# Altium schematic sheet RadioPod.SchDoc
size A3; PageSetup: Record=PageOptions|CenterHorizontal=True|CenterVertical=True|PrintScale=1.00|XCorrection=1.00|YCorrection=1.00|PrintKind=1|BorderSize=5000000|LeftOffset=0|BottomOffset=0|Orientation=2|PaperLength=1000|PaperWidth=1000|Scale=100|PaperSource=7|PrintQuality=-3|MediaType=1|DitherType=10|PrintScaleMode=1|PaperKind=A4|PaperIndex=9
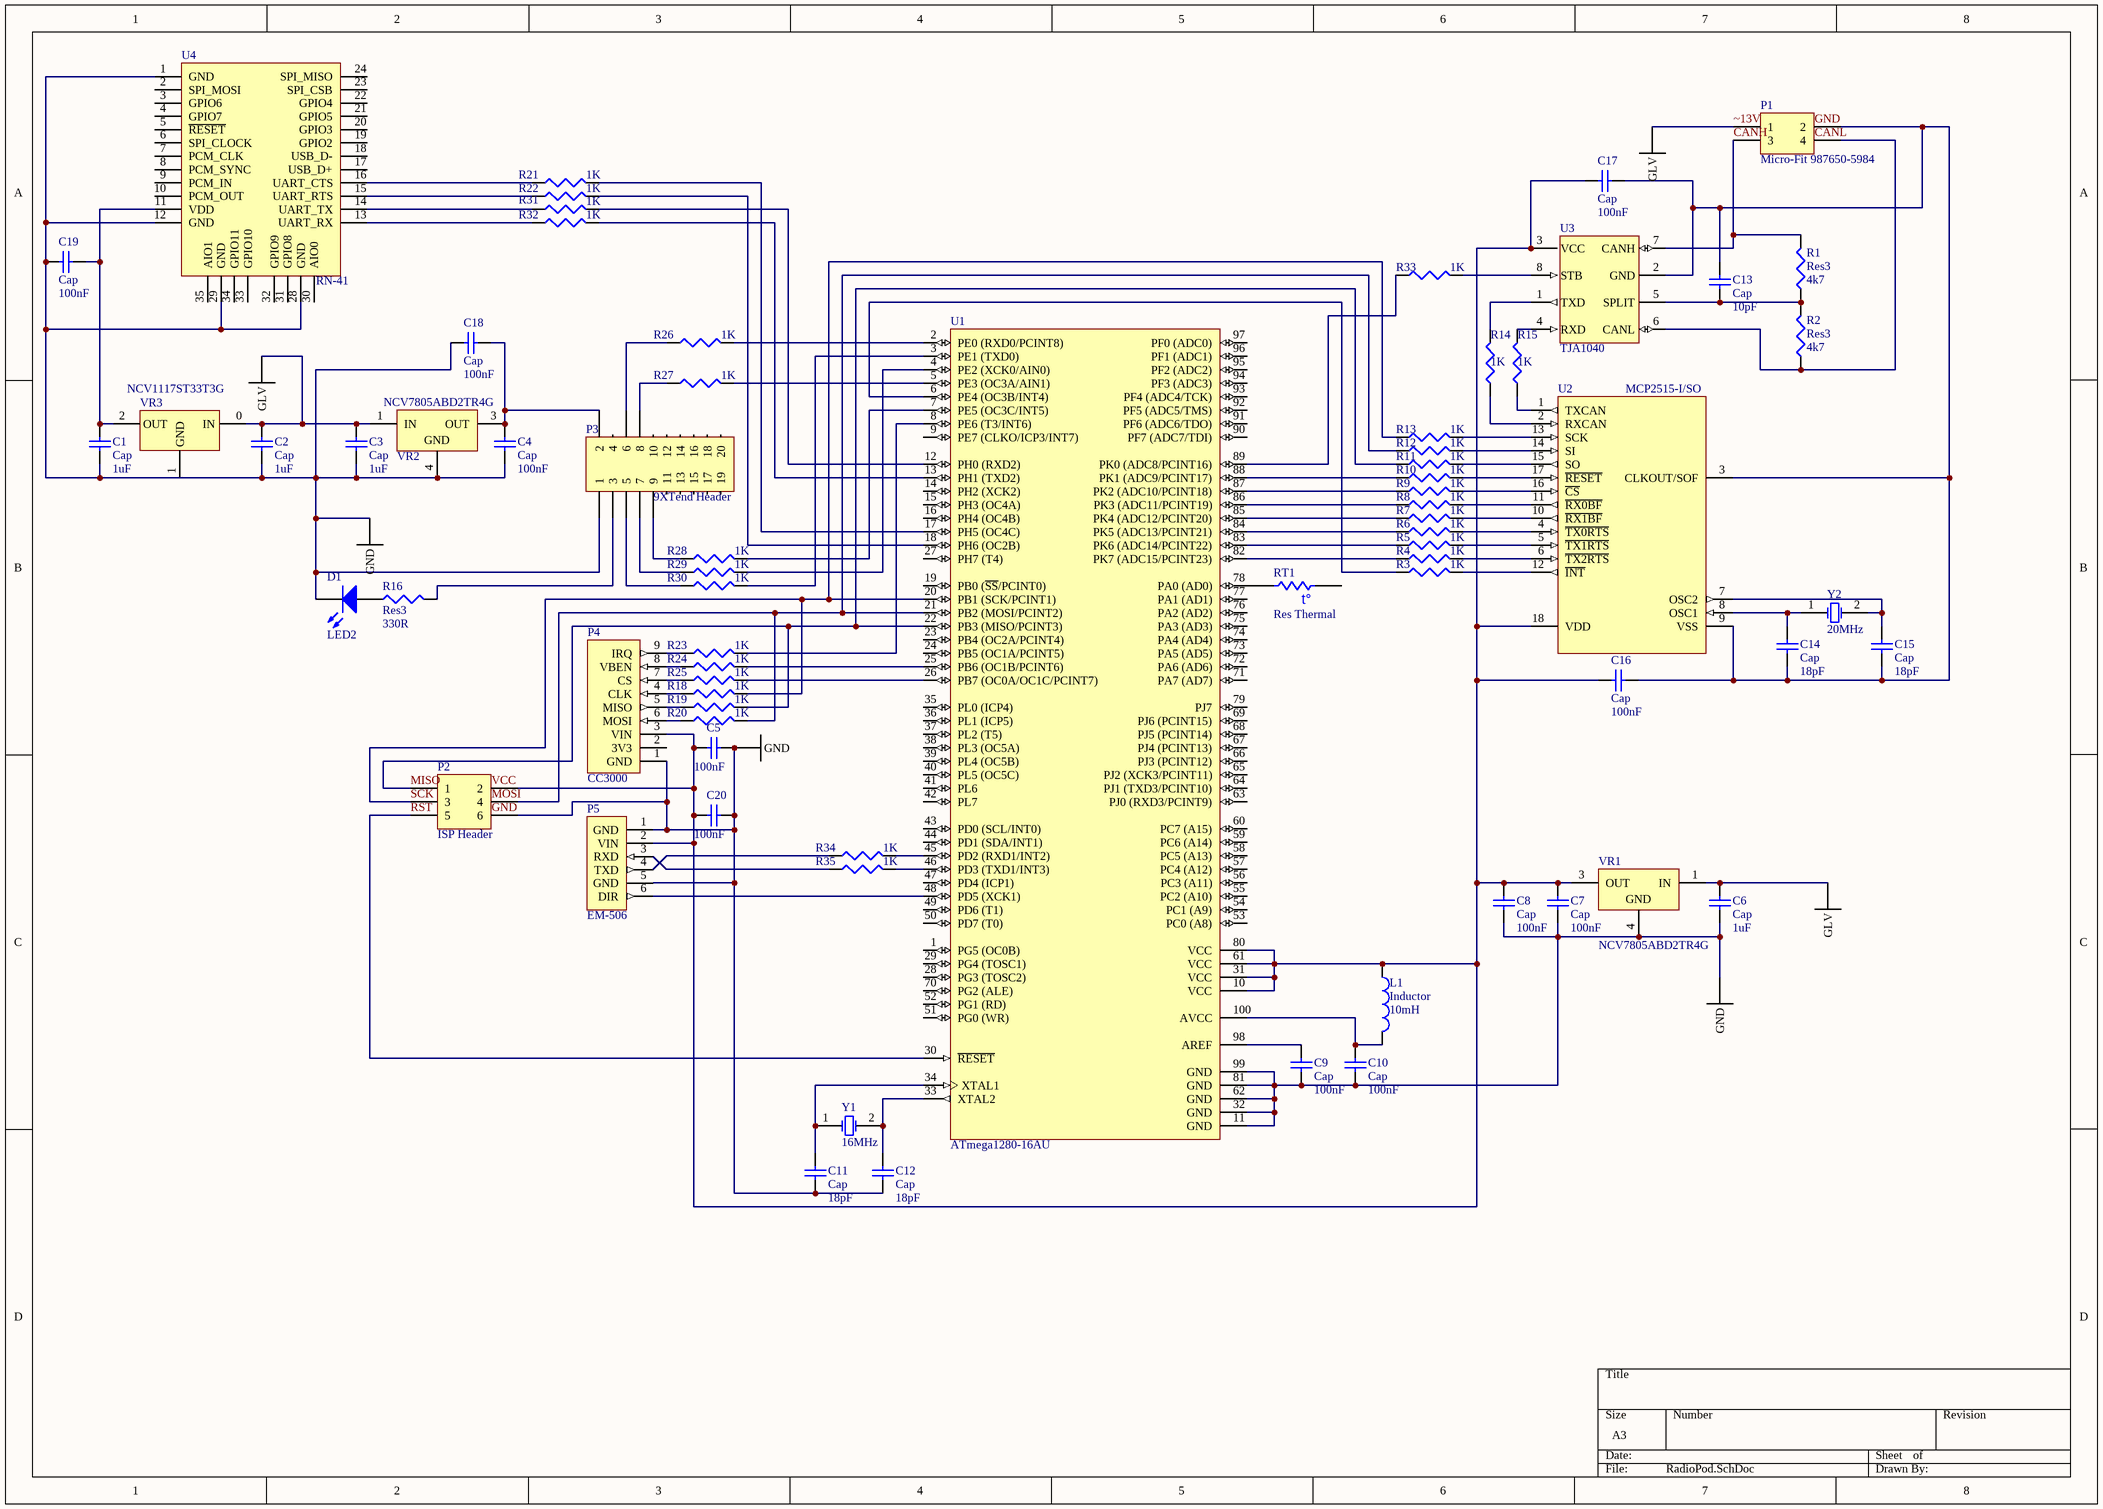
[diagram p0: RadioPod.SchDoc]

## Parts
C1  Cap  value 1uF  [RAD-0.3]
C2  Cap  value 1uF  [RAD-0.3]
C3  Cap  value 1uF  [RAD-0.3]
C4  Cap  value 100nF  [RAD-0.3]
C5  value 100nF  [RAD-0.3]  (hidden comment: Cap)
C6  Cap  value 1uF  [RAD-0.3]
C7  Cap  value 100nF  [RAD-0.3]
C8  Cap  value 100nF  [RAD-0.3]
C9  Cap  value 100nF  [RAD-0.3]
C10  Cap  value 100nF  [RAD-0.3]
C11  Cap  value 18pF  [RAD-0.3]
C12  Cap  value 18pF  [RAD-0.3]
C13  Cap  value 10pF  [RAD-0.3]
C14  Cap  value 18pF  [RAD-0.3]
C15  Cap  value 18pF  [RAD-0.3]
C16  Cap  value 100nF  [RAD-0.3]
C17  Cap  value 100nF  [RAD-0.3]
C18  Cap  value 100nF  [RAD-0.3]
C19  Cap  value 100nF  [RAD-0.3]
C20  value 100nF  [RAD-0.3]  (hidden comment: Cap)
D1  LED2  [3.2X1.6X1.1]
L1  Inductor  value 10mH  [0402-A]
P1  Micro-Fit 987650-5984  [HDR2X2]
P2  ISP Header  [HDR2X3]
P3  9XTend Header  [HDR2X10]
P4  CC3000  [Header 9]
P5  EM-506  [EM_506]
R1  Res3  value 4k7  [J1-0603]
R2  Res3  value 4k7  [J1-0603]
R3  value 1K  [J1-0603]  (hidden comment: Res3)
R4  value 1K  [J1-0603]  (hidden comment: Res3)
R5  value 1K  [J1-0603]  (hidden comment: Res3)
R6  value 1K  [J1-0603]  (hidden comment: Res3)
R7  value 1K  [J1-0603]  (hidden comment: Res3)
R8  value 1K  [J1-0603]  (hidden comment: Res3)
R9  value 1K  [J1-0603]  (hidden comment: Res3)
R10  value 1K  [J1-0603]  (hidden comment: Res3)
R11  value 1K  [J1-0603]  (hidden comment: Res3)
R12  value 1K  [J1-0603]  (hidden comment: Res3)
R13  value 1K  [J1-0603]  (hidden comment: Res3)
R14  value 1K  [J1-0603]  (hidden comment: Res3)
R15  value 1K  [J1-0603]  (hidden comment: Res3)
R16  Res3  value 330R  [J1-0603]
R18  value 1K  [J1-0603]  (hidden comment: Res3)
R19  value 1K  [J1-0603]  (hidden comment: Res3)
R20  value 1K  [J1-0603]  (hidden comment: Res3)
R21  value 1K  [J1-0603]  (hidden comment: Res3)
R22  value 1K  [J1-0603]  (hidden comment: Res3)
R23  value 1K  [J1-0603]  (hidden comment: Res3)
R24  value 1K  [J1-0603]  (hidden comment: Res3)
R25  value 1K  [J1-0603]  (hidden comment: Res3)
R26  value 1K  [J1-0603]  (hidden comment: Res3)
R27  value 1K  [J1-0603]  (hidden comment: Res3)
R28  value 1K  [J1-0603]  (hidden comment: Res3)
R29  value 1K  [J1-0603]  (hidden comment: Res3)
R30  value 1K  [J1-0603]  (hidden comment: Res3)
R31  value 1K  [J1-0603]  (hidden comment: Res3)
R32  value 1K  [J1-0603]  (hidden comment: Res3)
R33  value 1K  [J1-0603]  (hidden comment: Res3)
R34  value 1K  [J1-0603]  (hidden comment: Res3)
R35  value 1K  [J1-0603]  (hidden comment: Res3)
RT1  Res Thermal  [6-0805_N]
T1  GLV_Terminal  (value not drawn)
T2  GLV_Terminal  (value not drawn)
T3  GND_Terminal  (value not drawn)
T4  GND_Terminal  (value not drawn)
T5  GND_Terminal  (value not drawn)
T6  GLV_Terminal  (value not drawn)
U1  ATmega1280-16AU  [100A_N]
U2  MCP2515-I/SO  [SOIC-SO18_N]
U3  TJA1040  [SO8_L]
U4  RN-41  [RN41]
VR1  NCV7805ABD2TR4G  [936-03]
VR2  NCV7805ABD2TR4G  [936-03]
VR3  NCV1117ST33T3G  [SOT223_M]
Y1  16MHz  [R38]
Y2  20MHz  [R38]

## Nets
CANH: P1.3 R1.2 U3.7(CANH)
MISO: P2.1 R11.1 R19.2 U1.22(PB3_(MISO/PCINT3))
RST: P2.5 U1.30(~{RESET})
SCK: P2.3 R13.1 R18.2 U1.20(PB1_(SCK/PCINT1))
~13V: P1.1 T1.36(GLV)
NetC1_1: C1.1 C2.1 C3.1 C4.1 C18.2 C19.2 D1.2(K) P3.1 T3.0(GND) U4.1(GND) U4.12(GND) U4.28(GND) U4.29(GND) VR2.4(GND)
NetC1_2: C1.2 C19.1 U4.11(VDD) VR3.2(OUT)
NetC2_2: C2.2 C3.2 T2.36(GLV) VR2.1(IN) VR3.0(IN)
NetC4_2: C4.2 C18.1 P3.2 VR2.3(OUT)
NetC5_1: C5.1 C11.1 C12.1 C20.2 P2.6 P4.1(GND) P5.1(GND) P5.5(GND) T4.0(GND)
NetC5_2: C5.2 C7.2 C8.2 C16.2 C17.2 C20.1 L1.1 P2.2 P4.3(VIN) P5.2(VIN) U1.10(VCC) U1.31(VCC) U1.61(VCC) U1.80(VCC) U2.18(VDD) U3.3(VCC) VR1.3(OUT)
NetC6_1: C6.1 C7.1 C8.1 C9.1 C10.1 T5.0(GND) U1.11(GND) U1.32(GND) U1.62(GND) U1.81(GND) U1.99(GND) VR1.4(GND)
NetC6_2: C6.2 T6.36(GLV) VR1.1(IN)
NetC9_2: C9.2 U1.98(AREF)
NetC10_2: C10.2 L1.2 U1.100(AVCC)
NetC11_2: C11.2 U1.34(XTAL1) Y1.1(OSC1)
NetC12_2: C12.2 U1.33(XTAL2) Y1.2(OSC2)
NetC13_1: C13.1 C14.1 C15.1 C16.1 C17.1 P1.2 U2.3(CLKOUT/SOF) U2.9(VSS) U3.2(GND)
NetC13_2: C13.2 R1.1 R2.2 U3.5(SPLIT)
NetC14_2: C14.2 U2.8(OSC1) Y2.1(OSC1)
NetC15_2: C15.2 U2.7(OSC2) Y2.2(OSC2)
NetP1_4: P1.4 R2.1 U3.6(CANL)
NetP2_4: P2.4 R12.1 R20.2 U1.21(PB2_(MOSI/PCINT2))
NetP3_3: P3.3 R16.2
NetP3_5: P3.5 R30.1
NetP3_6: P3.6 R26.1
NetP3_7: P3.7 R29.1
NetP3_8: P3.8 R27.1
NetP3_9: P3.9 R28.1
NetP4_4: P4.4(CLK) R18.1
NetP4_5: P4.5(MISO) R19.1
NetP4_6: P4.6(MOSI) R20.1
NetP4_7: P4.7(CS) R25.1
NetP4_8: P4.8(VBEN) R24.1
NetP4_9: P4.9(IRQ) R23.1
NetP5_3: P5.3(RXD) R35.1
NetP5_4: P5.4(TXD) R34.1
NetP5_6: P5.6(DIR) U1.48(PD5_(XCK1))
NetR3_1: R3.1 U1.6(PE4_(OC3B/INT4))
NetR3_2: R3.2 U2.12(~{INT})
NetR4_1: R4.1 U1.82(PK7_(ADC15/PCINT23))
NetR4_2: R4.2 U2.6(~{TX2RTS})
NetR5_1: R5.1 U1.83(PK6_(ADC14/PCINT22))
NetR5_2: R5.2 U2.5(~{TX1RTS})
NetR6_1: R6.1 U1.84(PK5_(ADC13/PCINT21))
NetR6_2: R6.2 U2.4(~{TX0RTS})
NetR7_1: R7.1 U1.85(PK4_(ADC12/PCINT20))
NetR7_2: R7.2 U2.10(~{RX1BF})
NetR8_1: R8.1 U1.86(PK3_(ADC11/PCINT19))
NetR8_2: R8.2 U2.11(~{RX0BF})
NetR9_1: R9.1 U1.87(PK2_(ADC10/PCINT18))
NetR9_2: R9.2 U2.16(~{CS})
NetR10_1: R10.1 U1.88(PK1_(ADC9/PCINT17))
NetR10_2: R10.2 U2.17(~{RESET})
NetR11_2: R11.2 U2.15(SO)
NetR12_2: R12.2 U2.14(SI)
NetR13_2: R13.2 U2.13(SCK)
NetR14_1: R14.1 U2.2(RXCAN)
NetR14_2: R14.2 U3.1(TXD)
NetR15_1: R15.1 U2.1(TXCAN)
NetR15_2: R15.2 U3.4(RXD)
NetR21_1: R21.1 U4.16(UART_CTS)
NetR21_2: R21.2 U1.17(PH5_(OC4C))
NetR22_1: R22.1 U4.15(UART_RTS)
NetR22_2: R22.2 U1.18(PH6_(OC2B))
NetR23_2: R23.2 U1.8(PE6_(T3/INT6))
NetR24_2: R24.2 U1.25(PB6_(OC1B/PCINT6))
NetR25_2: R25.2 U1.26(PB7_(OC0A/OC1C/PCINT7))
NetR26_2: R26.2 U1.2(PE0_(RXD0/PCINT8))
NetR27_2: R27.2 U1.5(PE3_(OC3A/AIN1))
NetR28_2: R28.2 U1.7(PE5_(OC3C/INT5))
NetR29_2: R29.2 U1.4(PE2_(XCK0/AIN0))
NetR30_2: R30.2 U1.3(PE1_(TXD0))
NetR31_1: R31.1 U4.14(UART_TX)
NetR31_2: R31.2 U1.12(PH0_(RXD2))
NetR32_1: R32.1 U4.13(UART_RX)
NetR32_2: R32.2 U1.13(PH1_(TXD2))
NetR33_1: R33.1 U1.89(PK0_(ADC8/PCINT16))
NetR33_2: R33.2 U3.8(STB)
NetR34_2: R34.2 U1.45(PD2_(RXD1/INT2))
NetR35_2: R35.2 U1.46(PD3_(TXD1/INT3))
NetRT1_2: RT1.2 U1.78(PA0_(AD0))

Not connected (* = marked no-connect by the designer): D1 1(A); P3 4 10 11 12 13 14 15 16 17 18 19 20; P4 2(3V3); R16 1; RT1 1; U1 1(PG5_(OC0B)) 9(PE7_(CLKO/ICP3/INT7)) 14(PH2_(XCK2)) 15(PH3_(OC4A)) 16(PH4_(OC4B)) 19(PB0_(~{SS}/PCINT0)) 23(PB4_(OC2A/PCINT4)) 24(PB5_(OC1A/PCINT5)) 27(PH7_(T4)) 28(PG3_(TOSC2)) 29(PG4_(TOSC1)) 35(PL0_(ICP4)) 36(PL1_(ICP5)) 37(PL2_(T5)) 38(PL3_(OC5A)) 39(PL4_(OC5B)) 40(PL5_(OC5C)) 41(PL6) 42(PL7) 43(PD0_(SCL/INT0)) 44(PD1_(SDA/INT1)) 47(PD4_(ICP1)) 49(PD6_(T1)) 50(PD7_(T0)) 51(PG0_(WR)) 52(PG1_(RD)) 53(PC0_(A8)) 54(PC1_(A9)) 55(PC2_(A10)) 56(PC3_(A11)) 57(PC4_(A12)) 58(PC5_(A13)) 59(PC6_(A14)) 60(PC7_(A15)) 63(PJ0_(RXD3/PCINT9)) 64(PJ1_(TXD3/PCINT10)) 65(PJ2_(XCK3/PCINT11)) 66(PJ3_(PCINT12)) 67(PJ4_(PCINT13)) 68(PJ5_(PCINT14)) 69(PJ6_(PCINT15)) 70(PG2_(ALE)) 71(PA7_(AD7)) 72(PA6_(AD6)) 73(PA5_(AD5)) 74(PA4_(AD4)) 75(PA3_(AD3)) 76(PA2_(AD2)) 77(PA1_(AD1)) 79(PJ7) 90(PF7_(ADC7/TDI)) 91(PF6_(ADC6/TDO)) 92(PF5_(ADC5/TMS)) 93(PF4_(ADC4/TCK)) 94(PF3_(ADC3)) 95(PF2_(ADC2)) 96(PF1_(ADC1)) 97(PF0_(ADC0)); U4 2(SPI_MOSI) 3(GPIO6) 4(GPIO7) 5(~{RESET}) 6(SPI_CLOCK) 7(PCM_CLK) 8(PCM_SYNC) 9(PCM_IN) 10(PCM_OUT) 17(USB_D+) 18(USB_D-) 19(GPIO2) 20(GPIO3) 21(GPIO5) 22(GPIO4) 23(SPI_CSB) 24(SPI_MISO) 30(AIO0) 31(GPIO8) 32(GPIO9) 33(GPIO10) 34(GPIO11) 35(AIO1); VR3 1(GND)

## Notes on the sheet
- Labels drawn without touching a wire or pin: CANL, GND, MOSI, VCC
- (in symbol Res Thermal) t°

## Library data of the parts
C1-C20 = Cap: Capacitor; Published: 8-Jun-2000; LatestRevisionDate: 17-Jul-2002; LatestRevisionNote: Re-released for DXP Platform.; PackageReference: RAD-0.3; Publisher: Altium Limited; PackageDescription: Radial Cap, Thru-Hole; 2 Leads; 0.3 in Pin Spacing
D1 = LED2: Typical RED, GREEN, YELLOW, AMBER GaAs LED; Published: 8-Jun-2000; LatestRevisionDate: 17-Jul-2002; LatestRevisionNote: Re-released for DXP Platform.; PackageVersion: Feb-2002; PackageReference: 3.2X1.6X1.1; Publisher: Altium Limited; PackageDescription: SM LED; 2 Flat Leads
L1 = Inductor: Code_IEC: 1005; Published: 8-Jun-2000; LatestRevisionDate: 29-May-2009; LatestRevisionNote: IPC-7351 Footprint Added.; PackageReference: 0402-A; Publisher: Altium Limited; PackageDescription: Chip Inductor; Code_JEITA: 0402
P1 = Header 2X2: Header, 2-Pin, Dual row; LatestRevisionDate: 17-Jul-2002; LatestRevisionNote: Re-released for DXP Platform.; Publisher: Altium Limited
P2 = Header 3X2: Header, 3-Pin, Dual row; LatestRevisionDate: 17-Jul-2002; LatestRevisionNote: Re-released for DXP Platform.; Publisher: Altium Limited
P3 = Header 10X2: Header, 10-Pin, Dual row; LatestRevisionDate: 17-Jul-2002; LatestRevisionNote: Re-released for DXP Platform.; Publisher: Altium Limited
P4 = CC3000: CC3000 Wifi Module
P5 = EM-506: EM-506 GPS Module Pads
R1-R16 R18-R35 = Res3: Resistor; Published: 8-Jun-2000; LatestRevisionDate: 29-May-2009; LatestRevisionNote: IPC-7351 Footprint Added.; PackageReference: J1-0603; Publisher: Altium Limited; PackageDescription: Chip Resistor
RT1 = Res Thermal: Thermistor; Published: 24-Mar-1999; LatestRevisionDate: 29-May-2009; LatestRevisionNote: IPC-7351 Footprint Added.; PackageVersion: Mar-2003; PackageReference: 6-0805; Publisher: Altium Limited; PackageDescription: Chip Resistor 0805 Case Size; Code_IPC: RESC2012
U1 = ATmega1280-16AU: 8-bit AVR Microcontroller, 2.7-5.5V, 128KB Flash, 4KB EEPROM, 8KB SRAM, 86 GPIO pins, 100-pin TQFP, Industrial Grade (-40°C to 85°C), Pb-Free; Published: 1-Apr-2010; DatasheetVersion: revL, Aug-2007; PackageVersion: revC, Oct-2001; PackageReference: 100A; Publisher: Altium Limited; PackageDescription: 100-Pin Thin Profile Plastic Quad Flat Pack (TQFP), 14 x 14 x 1.0 mm Body, 0.5 mm Pitch; Supplier 1: Digi-Key; Supplier Part Number 1: ATMEGA1280-16AU-ND; Supplier 2: Farnell; Supplier Part Number 2: 1455090; Supplier 3: Mouser; Supplier Part Number 3: 556-ATMEGA1280-16AU; Code_JEDEC: MS-026-AED; ComponentLink1Description: Manufacturer Link; ComponentLink1URL: http://www.atmel.com/products/avr/default.asp?; ComponentLink2Description: ATmega640/1280/1281/2560/2561 Datasheet; ComponentLink2URL: http://www.atmel.com/dyn/resources/prod_documents/doc2549.pdf; ComponentLink3Description: ATmega640/1280/1281/2560/2561 Summary; ComponentLink3URL: http://www.atmel.com/dyn/resources/prod_documents/2549S.pdf; ComponentLink4Description: Atmel.com Home; ComponentLink4URL: http://www.atmel.com
U2 = MCP2515-I/SO: Stand-Alone CAN Controller With SPI Interface, 18-Pin SOIC, Industrial Temperature; Published: 29-Jan-2009; DatasheetVersion: revE, Nov-2007; PackageVersion: revBB, Aug-2009; PackageReference: SOIC-SO18; Publisher: Altium Limited; PackageDescription: 18-Lead Plastic Small Outline (SO) - Wide 7.50mm Body [SOIC]; Supplier 1: Digi-Key; Supplier Part Number 1: MCP2515-I/SO-ND; Supplier 2: Farnell; Supplier Part Number 2: 1292239; Code_JEDEC: MS-013; ComponentLink1Description: Datasheet; ComponentLink1URL: http://ww1.microchip.com/downloads/en/DeviceDoc/21801e.pdf; ComponentLink2Description: Packaging Specification; ComponentLink2URL: http://www.microchip.com/stellent/groups/techpub_sg/documents/packagingspec/en012702.pdf; ComponentLink3Description: Microchip.com Home; ComponentLink3URL: http://www.microchip.com/
U4 = RN41: RN-41 Bluetooth Module
VR1 VR2 = MC7805ACD2T: Three-Terminal Positive Voltage Regulator; Note: Pin 2 is electrically connected to Pin 4; Pin 2 is trimmed and not drawn;; Published: 15-Apr-2002; DatasheetVersion: 1997; PackageVersion: 1997; PackageReference: 936-03; Publisher: Altium Limited; PackageDescription: D2-PAK/TO-263-AB; 3 Leads (1 Cropped); Body 14.7 (inc. leads) x 10.2 mm (LxW max); ComponentLink1Description: Manufacturer Link; ComponentLink1URL: http://www.onsemi.com/site/products/taxonomy/0,4438,503,00.html; ComponentLink2Description: Datasheet; ComponentLink2URL: http://www.onsemi.com/pub/Collateral/MC7800-D.PDF
Y1 Y2 = XTAL: Crystal Oscillator; Published: 8-Jun-2000; LatestRevisionDate: 17-Jul-2002; LatestRevisionNote: Re-released for DXP Platform.; PackageReference: R38; Publisher: Altium Limited; PackageDescription: Crystal, Thru-Hole; 2 Leads; Body 3.1 x 8.2 mm (Dia.xH)
VR3 = NCV1117ST33T3G: Package Description: SOT−223